# Altium schematic sheet LevelShifter.SchDoc
size A
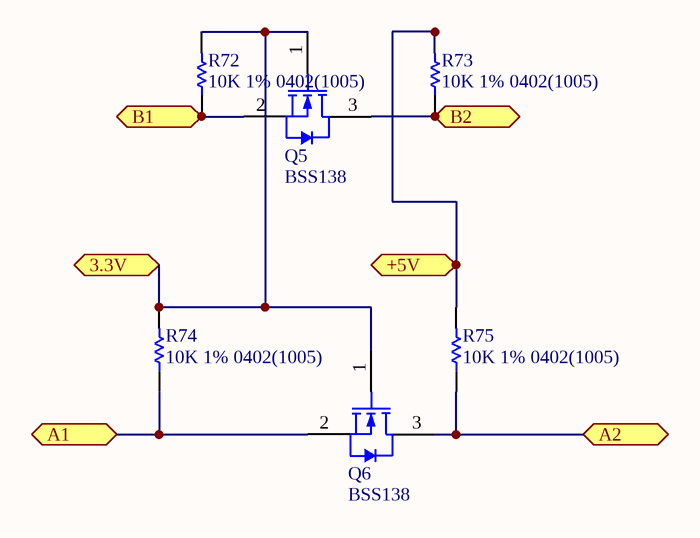
[diagram p0: LevelShifter.SchDoc]

## Parts
Q5  BSS138  [FAIR-SOT23-3_V]
Q6  BSS138  [FAIR-SOT23-3_V]
R72  10K 1% 0402(1005)  [RESC0402(1005)_L]
R73  10K 1% 0402(1005)  [RESC0402(1005)_L]
R74  10K 1% 0402(1005)  [RESC0402(1005)_L]
R75  10K 1% 0402(1005)  [RESC0402(1005)_L]

## Ports
3.3V, +5V, A1 (bidir), A2 (bidir), B1 (bidir), B2 (bidir)

## Nets
3.3V: Q5.1(G) Q6.1(G) R72.2 R74.2 ; port 3.3V
+5V: R73.2 R75.2 ; port +5V
A1: Q6.2(S) R74.1 ; port A1
A2: Q6.3(D) R75.1 ; port A2
B1: Q5.2(S) R72.1 ; port B1
B2: Q5.3(D) R73.1 ; port B2

## Library data of the parts
Q5 Q6 = CMP-1670-00009-1: N-Channel Logic Level Enhancement Mode Field Effect Transistor, 220 mA, 50 V, -55 to 150 degC, 3-Pin SOT-23, RoHS, Tape and Reel; ESR: 40 Ohm; Tolerance: 30ppm; Capacitance: 1.8E-11 f; Load Capacitance: 18 pF; Frequency: 12 MHz; Resistance: 100 Ohm; Min Operating Temperature: -20degC; ComponentLink2URL: https://www.fairchildsemi.com/datasheets/BS/BSS138.pdf; Max Operating Temperature: 70degC; Width: 0.126 inch; Pins: 4; Length: 0.197 inch; ComponentLink2Description: Datasheet; Package Quantity: 1; PackageReference: SOT23-3; Packaging: Tape and Reel; RoHSCompliant: True; Frequency Tolerance: 30ppm; ComponentLink3Description: Package Specification; Mount: Surface Mount; REACH SVHC: Unknown; Height: 0.041 inch; ComponentLink1URL: https://www.fairchildsemi.com/; PackageDescription: 3-Pin Small Outline Transistor, Body 2.92 x 1.325 mm, Pitch 0.95 mm; ComponentLink3URL: http://www.fairchildsemi.com/dwg/MA/MA03D.pdf; ComponentLink1Description: Manufacturer URL; DatasheetVersion: Rev. C, 10/2005
R72-R75 = CMP-1011-00623-1: 10K 0.063W 1% 0402 (1005 Metric)  SMD; Case-EIA: 0402; Value: 10000.00 Ohm; Case-Metric: 1005; Technology: SMT; Tolerance: 1 %; Power: 0.063 W